# EAGLE design MT3608-dip-board (EAGLE 8.3.1)
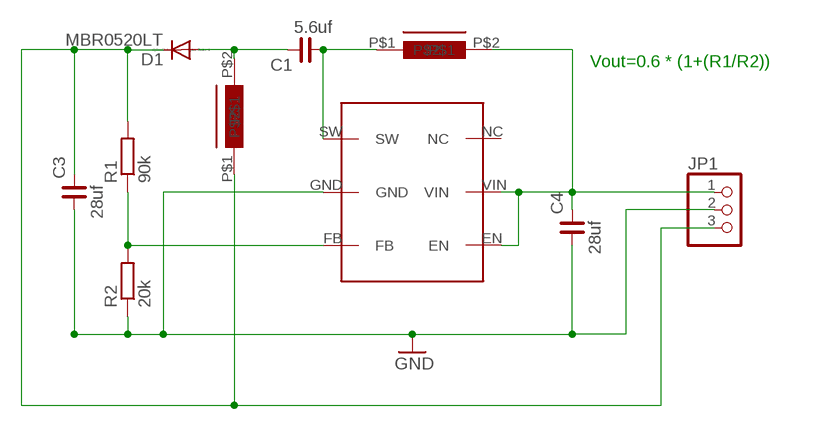
[diagram p0: schematic, sheet 1]

## Parts
22UH  CDRH74NP-220MC-B  [CDRH74NP-220MC-B]
C1  5.6uf  C_0805  [C0805]
C3  28uf  C_0805  [C0805]
C4  28uf  C_0805  [C0805]
D1  MBR0520LT  [SOD123]
JP1  PINHD-1X3  [1X03]
R1  90k  R-EU_R0805  [R0805]
R2  20k  R-EU_R0805  [R0805]
U$1  MT3608  [MT3608]
U$3  CDRH74NP-220MC-B  [CDRH74NP-220MC-B]

## Nets
GND: C3.1 C4.1 JP1.2 R2.1 U$1.GND
N$1: C4.2 JP1.1 U$1.EN U$1.VIN U$3.P$2
N$2: 22UH.P$2 C1.2 D1.A
N$3: C1.1 U$1.SW U$3.P$1
N$4: 22UH.P$1 C3.2 D1.C JP1.3 R1.2
N$5: R1.1 R2.2 U$1.FB
Unconnected: U$1.NC

## Notes on the sheet
- Vout=0.6 * (1+(R1/R2))

## Library data of the parts
22UH U$3 = mgvc:CDRH74NP-220MC-B: inductor SMD 22uH 1.23A
C1 C3 C4 = rc-master-smd:C_: NON-POLARIZED CAP
D1 = diode:MBR0520LT: SCHOTTKY BARRIER RECTIFIER Source: http://onsemi.com .. MBR0520LT1-D.pdf
JP1 = adafruit:PINHD-1X3: PIN HEADER
R1 R2 = resistor:R-EU_: RESISTOR, European symbol
U$1 = mgvc:MT3608: DC-DC step-up Входное напряжение: от 2V до 24V Фиксированная частота преобразования 1.2MHz Внутренний 4A ключ

## Board
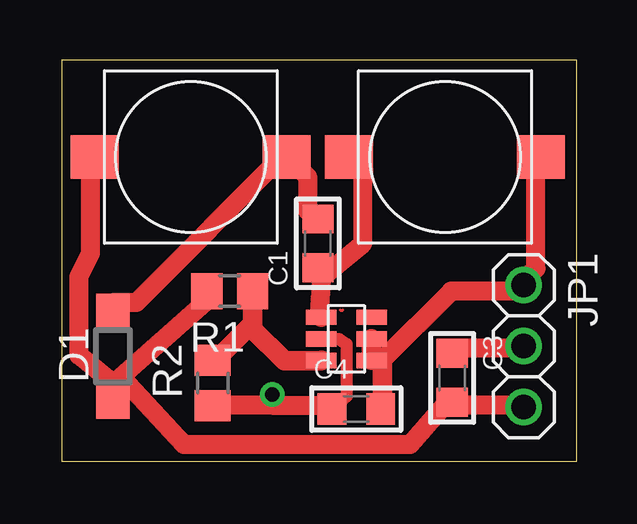
[diagram p1: board, top side]
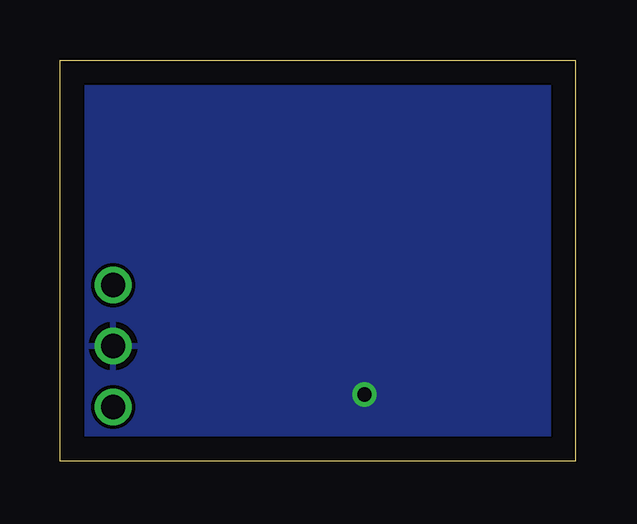
[diagram p2: board, bottom side, seen from below]

Size 21.49 x 16.71 mm. Coordinates in mm from the lower left corner, seen from the top.
Outline: 0,0 21.49,0 21.49,16.71 0,16.71 0,0
Copper layers (1*16): Top 0.035mm / dielectric 1.5mm / Bottom 0.035mm
Design rules "default *": minimum track width 0.8mm, minimum drill 0.35mm, track to track 6mil, track to pad 6mil, pad to pad 6mil, via to via 6mil, smd to smd 6mil, copper to edge 40mil, drill to drill 6mil, minimum pad ring 10mil, minimum via ring 8mil, stop-mask expansion 4mil, vias tented up to drill 0mil, thermal gap 10mil

### Footprints (pad centres in the part's own frame; a part is rotated, then mirrored left to right if it is on the bottom)
CDRH74NP-220MC-B = smd 2 x 1.8: P$1 -0.4,3.6; P$2 7.6,3.6
C0805 = smd 1.2 x 1.3: 1 -1.016,0; 2 1.016,0
SOD123 = smd 1.4 x 1.4: A 1.9,0; C -1.9,0
1X03 = drill 1.016: 1 -2.54,0; 2 0,0; 3 2.54,0
R0805 = smd 1.3 x 1.5: 1 -0.95,0; 2 0.95,0
MT3608 = smd 0.635 x 1.27: EN 2.3,0.3; FB 2.3,-1.8; GND 1.4,-1.8; NC 0.5,0.3; SW 0.5,-1.8; VIN 1.4,0.3

### Placement (x,y rotation side)
22UH  1.79,9.07 0 top
C1  10.69,9.07 90 top
C3  16.29,3.47 270 top
C4  12.29,2.17 0 top
D1  2.14,4.37 90 top
JP1  19.27,4.79 270 top
R1  7.01,7.08 180 top
R2  6.3,3.25 90 top
U$1  12.63,6.49 270 top
U$3  12.39,9.07 0 top

### Tracks (layer width: path | path; a pad name or v marks a point on that pad's centre or on a via)
GND  (via drill 0.6)
  Top 0.508: U$1.GND 11.57,5.09 11.89,4.87 11.89,2.69 C4.1
  Top 0.8: C3.1 16.45,4.7 18.83,4.7 JP1.2 | 8.83,2.32 6.45,2.32 R2.1 | 8.83,2.32 11.21,2.32 C4.1 | 8.83,2.32 v8.79,2.77
  pour Bottom: 22.19,16.67 -0.61,16.67 -0.61,0.07 22.19,0.07
N$1
  Top 0.8: U$3.P$2 19.78,12.32 19.78,8.03 19.31,7.56 JP1.1 18.83,7.08 16.25,7.08 13.39,4.22 13.39,3.97
  Top 0.813: U$1.VIN U$1.EN 13.17,4.19 13.39,3.97 13.39,2.25 C4.2
N$2
  Top 0.8: C1.2 10.26,10.41 10.26,11.84 9.78,12.32 22UH.P$2 9.31,12.79 3.11,6.6 2.16,6.6 D1.A
N$3
  Top 0.8: 10.83,7.63 10.73,6.13 U$1.SW | 10.83,7.63 12.56,9.06 12.56,12.32 U$3.P$1 | 10.83,7.63 C1.1
N$4
  Top 0.8: JP1.3 18.83,2.32 16.45,2.32 C3.2 15.97,2.32 14.54,0.69 5.09,0.69 2.48,3.51 | 2.48,3.51 5.97,6.6 R1.2 | 2.48,3.51 2.4,3.03 | 2.4,3.03 2.16,2.79 D1.C | 2.4,3.03 0.73,4.4 0.73,7.68 1.21,8.66 1.21,12.32 22UH.P$1
N$5
  Top 0.8: R2.2 6.45,4.22 7.88,5.65 7.96,5.5
  Top 0.813: R1.1 7.96,5.5 9.29,4.17 10.81,4.17 U$1.FB